# EAGLE design arbotix (EAGLE 5.07)
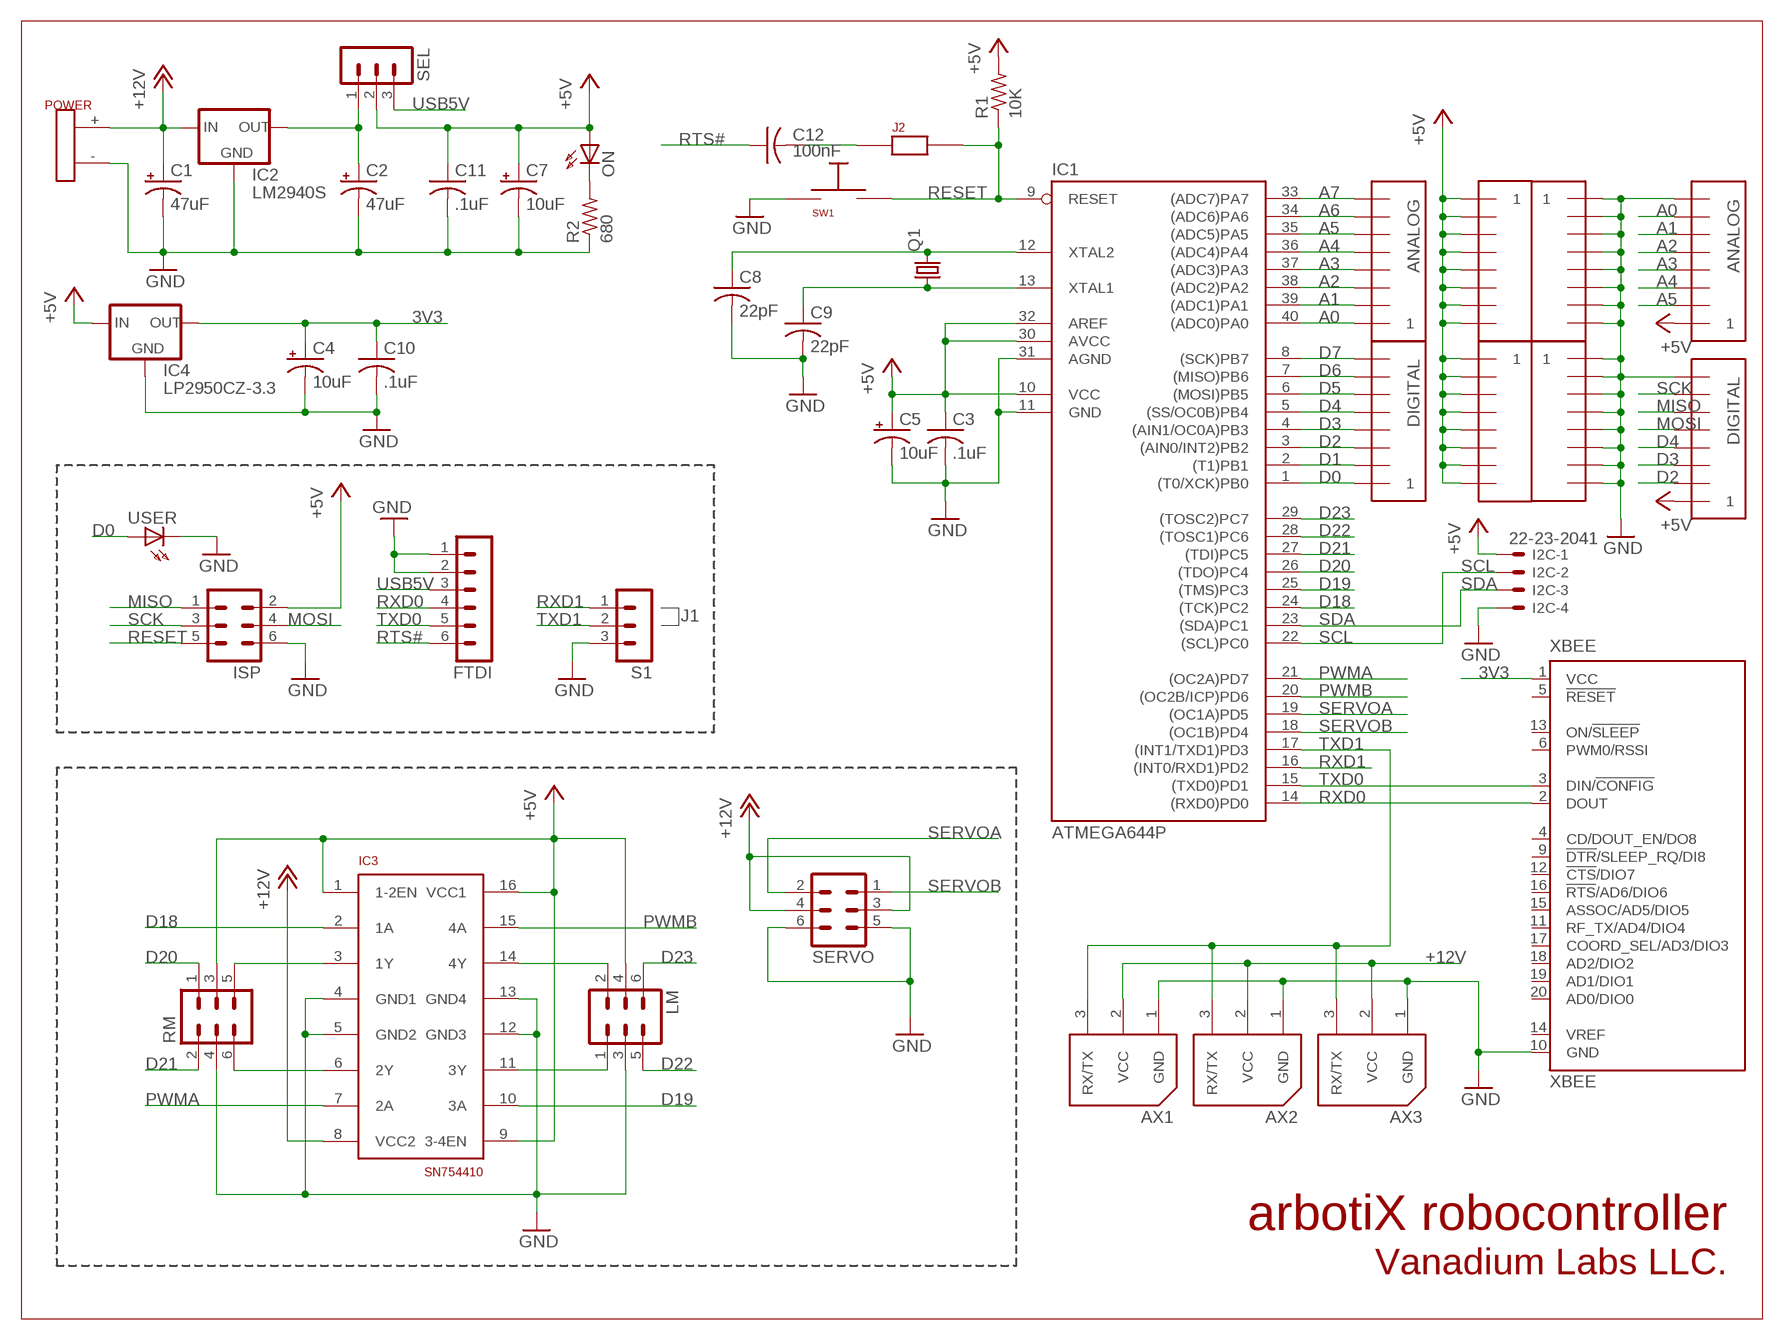
[diagram p0: schematic, sheet 1]

## Parts
AX1  WM18887-ND  [BIOLOID]
AX2  WM18887-ND  [BIOLOID]
AX3  WM18887-ND  [BIOLOID]
C1  47uF  CPOL-USTT2D5  [TT2D5]
C2  47uF  CPOL-USTT2D5  [TT2D5]
C3  .1uF  C-US025-024X044  [C025-024X044]
C4  10uF  CPOL-USTT2D5  [TT2D5]
C5  10uF  CPOL-USTT2D5  [TT2D5]
C7  10uF  CPOL-USTT2D5  [TT2D5]
C8  22pF  C-US025-024X044  [C025-024X044]
C9  22pF  C-US025-024X044  [C025-024X044]
C10  .1uF  C-US025-024X044  [C025-024X044]
C11  .1uF  C-US025-024X044  [C025-024X044]
C12  100nF  C-US025-024X044  [C025-024X044]
FTDI  MA06-1  [MA06-1]
I2C  22-23-2041  [22-23-2041]
IC1  ATMEGA644P  ATMEGA324P  [DIL40]
IC2  LM2940S  [TO220S]
IC3  SN754410  [DIL16]
IC4  LP2950CZ-3.3  [TO92]
ISP  MA03-2  [MA03-2]
J2  JUMPER  [2-PIN]
LM  MA03-2  [MA03-2]
ON  LED3MM  [LED3MM]
POWER  POWER  [POWER]
Q1  HC49/S  [HC49/S]
R1  10K  R-US_0204/7  [0204/7]
R2  680  R-US_0204/7  [0204/7]
RM  MA03-2  [MA03-2]
S1  MA03-1  [MA03-1]
SEL  MA03-1  [MA03-1]
SERVO  MA03-2  [MA03-2]
SW1  400-1646-ND  [MINISW]
U$1  HEADER8  [1X8]
U$2  HEADER8  [1X8]
U$3  HEADER16  [2X8]
U$4  HEADER8  [1X8]
U$11  HEADER16  [2X8]
U$12  HEADER8  [1X8]
USER  LED3MM  [LED3MM]
XBEE  XBEE  [XBEE]

## Nets
3V3: C4.+ C10.1 IC4.1(OUT) XBEE.1(VCC)
+5V: C3.1 C5.+ C7.+ C11.1 I2C.1 IC1.10(VCC) IC1.30(AVCC) IC1.32(AREF) IC3.1(1-2EN) IC3.9(3-4EN) IC3.16(VCC1) IC4.3(IN) ISP.2 LM.4 ON.A R1.2 RM.3 SEL.2 U$3.P$1 U$3.P$2 U$3.P$3 U$3.P$4 U$3.P$5 U$3.P$6 U$3.P$7 U$3.P$8 U$4.P$1 U$11.P$1 U$11.P$2 U$11.P$3 U$11.P$4 U$11.P$5 U$11.P$6 U$11.P$7 U$11.P$8 U$12.P$1
+12V: AX1.2(VCC) AX2.2(VCC) AX3.2(VCC) C1.+ IC2.1(IN) IC3.8(VCC2) POWER.+ SERVO.3 SERVO.4
A0: IC1.40((ADC0)PA0) U$1.P$1 U$12.P$7
A1: IC1.39((ADC1)PA1) U$1.P$2 U$12.P$6
A2: IC1.38((ADC2)PA2) U$1.P$3 U$12.P$5
A3: IC1.37((ADC3)PA3) U$1.P$4 U$12.P$4
A4: IC1.36((ADC4)PA4) U$1.P$5 U$12.P$3
A5: IC1.35((ADC5)PA5) U$1.P$6 U$12.P$2
A6: IC1.34((ADC6)PA6) U$1.P$7
A7: IC1.33((ADC7)PA7) U$1.P$8
D0: IC1.1((T0/XCK)PB0) U$2.P$1 USER.A
D1: IC1.2((T1)PB1) U$2.P$2
D2: IC1.3((AIN0/INT2)PB2) U$2.P$3 U$4.P$2
D3: IC1.4((AIN1/OC0A)PB3) U$2.P$4 U$4.P$3
D4: IC1.5((SS/OC0B)PB4) U$2.P$5 U$4.P$4
D18: IC1.24((TCK)PC2) IC3.2(1A)
D19: IC1.25((TMS)PC3) IC3.10(3A)
D20: IC1.26((TDO)PC4) RM.1
D21: IC1.27((TDI)PC5) RM.2
D22: IC1.28((TOSC1)PC6) LM.5
D23: IC1.29((TOSC2)PC7) LM.6
GND: AX1.1(GND) AX2.1(GND) AX3.1(GND) C1.- C2.- C3.2 C4.- C5.- C7.- C8.2 C9.2 C10.2 C11.2 FTDI.1 FTDI.2 I2C.4 IC1.11(GND) IC1.31(AGND) IC2.2(GND) IC3.4(GND1) IC3.5(GND2) IC3.12(GND3) IC3.13(GND4) IC4.2(GND) ISP.6 LM.3 POWER.- R2.1 RM.4 S1.3 SERVO.5 SERVO.6 SW1.2 U$3.P$9 U$3.P$10 U$3.P$11 U$3.P$12 U$3.P$13 U$3.P$14 U$3.P$15 U$3.P$16 U$4.P$8 U$11.P$9 U$11.P$10 U$11.P$11 U$11.P$12 U$11.P$13 U$11.P$14 U$11.P$15 U$11.P$16 U$12.P$8 USER.K(C) XBEE.10(GND)
MISO: IC1.7((MISO)PB6) ISP.1 U$2.P$7 U$4.P$6
MOSI: IC1.6((MOSI)PB5) ISP.4 U$2.P$6 U$4.P$5
N$1: IC3.11(3Y) LM.1
N$2: IC3.14(4Y) LM.2
N$3: IC3.3(1Y) RM.5
N$4: IC3.6(2Y) RM.6
N$5: C2.+ IC2.3(OUT) SEL.1
N$8: ON.K(C) R2.2
N$9: C8.1 IC1.12(XTAL2) Q1.2
N$11: C12.2 J2.P$1
N$13: C9.1 IC1.13(XTAL1) Q1.1
PWMA: IC1.21((OC2A)PD7) IC3.7(2A)
PWMB: IC1.20((OC2B/ICP)PD6) IC3.15(4A)
RESET: IC1.9(RESET) ISP.5 J2.P$2 R1.1 SW1.1
RTS#: C12.1 FTDI.6
RXD0: FTDI.4 IC1.14((RXD0)PD0) XBEE.2(DOUT)
RXD1: IC1.16((INT0/RXD1)PD2) S1.1
SCK: IC1.8((SCK)PB7) ISP.3 U$2.P$8 U$4.P$7
SCL: I2C.2 IC1.22((SCL)PC0)
SDA: I2C.3 IC1.23((SDA)PC1)
SERVOA: IC1.19((OC1A)PD5) SERVO.2
SERVOB: IC1.18((OC1B)PD4) SERVO.1
TXD0: FTDI.5 IC1.15((TXD0)PD1) XBEE.3(DIN/!CONFIG)
TXD1: AX1.3(RX/TX) AX2.3(RX/TX) AX3.3(RX/TX) IC1.17((INT1/TXD1)PD3) S1.2
USB5V: FTDI.3 SEL.3
Unconnected: XBEE.4(CD/DOUT_EN/DO8) XBEE.5(!RESET) XBEE.6(PWM0/RSSI) XBEE.9(!DTR!/SLEEP_RQ/DI8) XBEE.11(RF_TX/AD4/DIO4) XBEE.12(!CTS!/DIO7) XBEE.13(ON/!SLEEP) XBEE.14(VREF) XBEE.15(ASSOC/AD5/DIO5) XBEE.16(!RTS!/AD6/DIO6) XBEE.17(COORD_SEL/AD3/DIO3) XBEE.18(AD2/DIO2) XBEE.19(AD1/DIO1) XBEE.20(AD0/DIO0)

## Notes on the sheet
- ANALOG | ANALOG
- D7 | DIGITAL
- D6 | DIGITAL
- D5
- J1
- AX1 | AX2 | AX3
- arbotiX robocontroller
- Vanadium Labs LLC.

## Library data of the parts
AX1-AX3 = robots:WM18887-ND: Bioloid Bus Header Digikey Part No: WM18887-ND Molex/Waldom Electronics Corp 22-03-5035
C1 C2 C4 C5 C7 = rcl:CPOL-US: POLARIZED CAPACITOR, American symbol
C3 C8-C12 = rcl:C-US: CAPACITOR, American symbol
FTDI = con-lstb:MA06-1: PIN HEADER
I2C = con-molex:22-23-2041: .100" (2.54mm) Center Header - 4 Pin
IC1 = avr:ATMEGA324P
IC2 = robots:LM2940: LM2940 LDO REGULATOR
IC3 = robots:SN754410
IC4 = v-reg:LP2950?*: Source: http://cache.national.com/ds/LP/LP2950.pdf
ISP LM RM SERVO = con-lstb:MA03-2: PIN HEADER
J2 = robots:JUMPER
ON USER = led:LED3MM: LED 3 mm, round
POWER = robots:POWER
Q1 = crystal:HC49/S: CRYSTAL
R1 R2 = rcl:R-US_: RESISTOR, American symbol
S1 SEL = con-lstb:MA03-1: PIN HEADER
SW1 = robots:400-1646-ND: Mini Switch
U$1 U$2 U$4 U$12 = robots:HEADER8
U$3 U$11 = robots:HEADER16
XBEE = maxstream:XBEE: XBee (TM) /XBee-PRO(TM) OEM RF Modules Source: MaxStream, Inc. xbee_productmanual.pdf

## Board
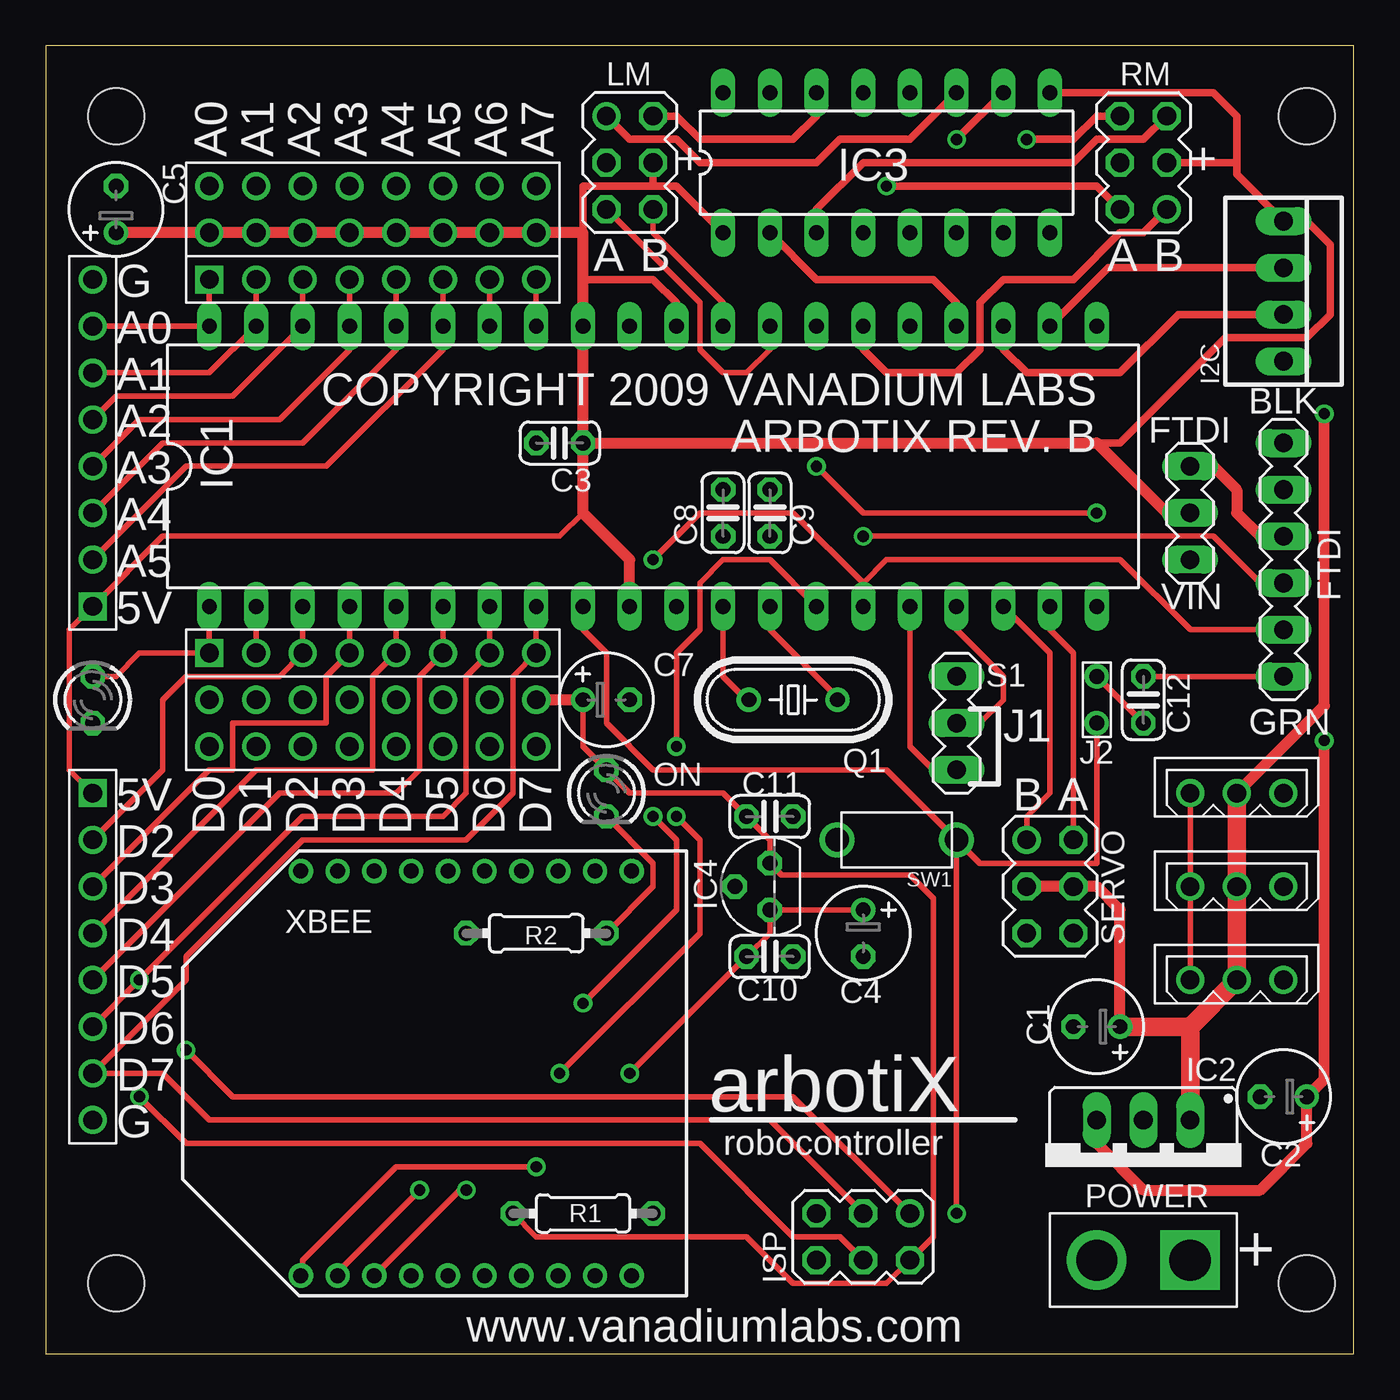
[diagram p1: board, top side]
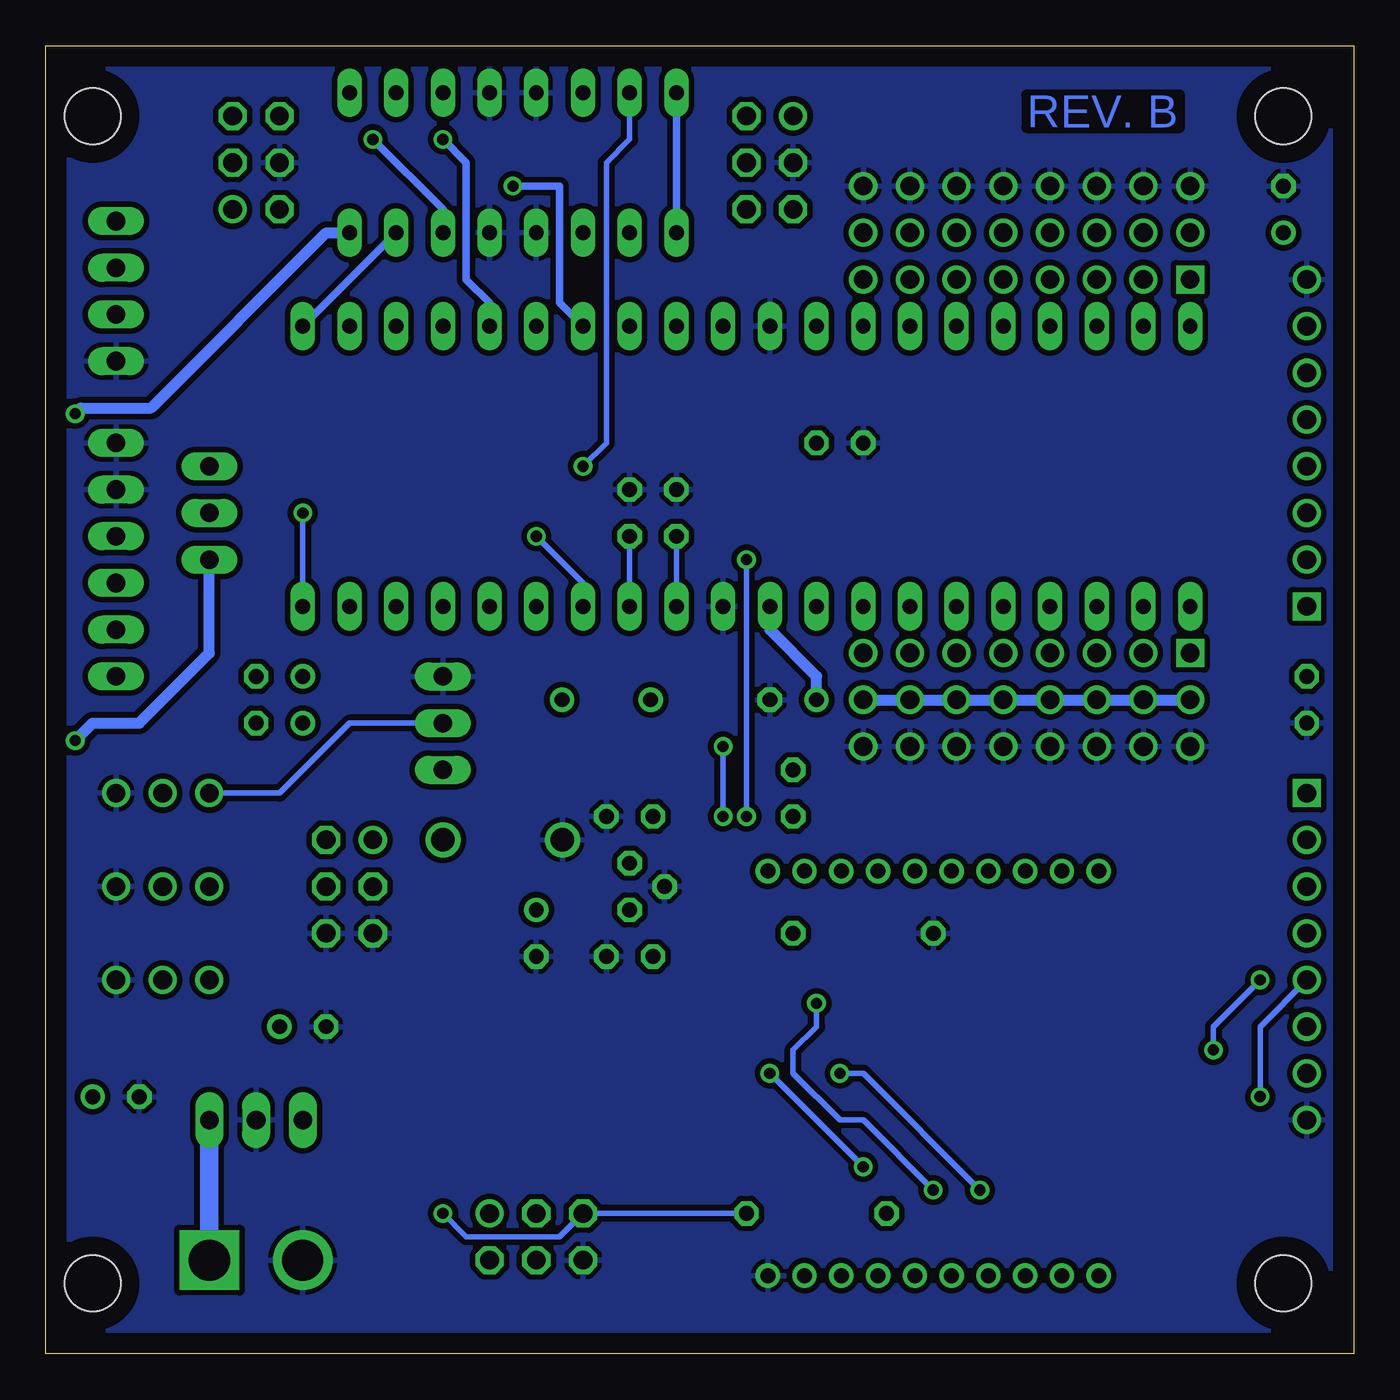
[diagram p2: board, bottom side, seen from below]

Size 71.12 x 71.12 mm. Coordinates in mm from the lower left corner, seen from the top.
Outline: 0,0 71.12,0 71.12,71.12 0,71.12 0,0
Copper layers (1*16): Top 0.035mm / dielectric 1.5mm / Bottom 0.035mm
Design rules "default *": minimum track width 10mil, minimum drill 24mil, track to track 8mil, track to pad 8mil, pad to pad 8mil, via to via 8mil, smd to smd 8mil, copper to edge 40mil, drill to drill 8mil, minimum pad ring 10mil, minimum via ring 8mil, stop-mask expansion 4mil, vias tented up to drill 24mil, thermal gap 10mil
Holes 3.05 mm at 3.81,67.31 68.58,67.31 68.58,3.81 3.81,3.81

### Footprints (pad centres in the part's own frame; a part is rotated, then mirrored left to right if it is on the bottom)
BIOLOID = drill 1.016 round: 1 0,0; 2 2.54,0; 3 5.08,0
TT2D5 = drill 0.813 round: + -1.27,0 | drill 0.813 octagon: - 1.27,0
C025-024X044 = drill 0.813 octagon: 1 -1.27,0; 2 1.27,0
MA06-1 = drill 1.016 long: 1 -6.35,0; 2 -3.81,0; 3 -1.27,0; 4 1.27,0; 5 3.81,0; 6 6.35,0
22-23-2041 = drill 1.016 long: 1 -3.81,0; 2 -1.27,0; 3 1.27,0; 4 3.81,0
DIL40 = drill 0.813 long: 1 -24.13,-7.62; 2 -21.59,-7.62; 3 -19.05,-7.62; 4 -16.51,-7.62; 5 -13.97,-7.62; 6 -11.43,-7.62; 7 -8.89,-7.62; 8 -6.35,-7.62; 9 -3.81,-7.62; 10 -1.27,-7.62; 11 1.27,-7.62; 12 3.81,-7.62; 13 6.35,-7.62; 14 8.89,-7.62; 15 11.43,-7.62; 16 13.97,-7.62; 17 16.51,-7.62; 18 19.05,-7.62; 19 21.59,-7.62; 20 24.13,-7.62; 21 24.13,7.62; 22 21.59,7.62; 23 19.05,7.62; 24 16.51,7.62; 25 13.97,7.62; 26 11.43,7.62; 27 8.89,7.62; 28 6.35,7.62; 29 3.81,7.62; 30 1.27,7.62; 31 -1.27,7.62; 32 -3.81,7.62; 33 -6.35,7.62; 34 -8.89,7.62; 35 -11.43,7.62; 36 -13.97,7.62; 37 -16.51,7.62; 38 -19.05,7.62; 39 -21.59,7.62; 40 -24.13,7.62
TO220S = drill 1.016 long: 1 -2.54,1.27; 2 0,1.27; 3 2.54,1.27
DIL16 = drill 0.813 long: 1 -8.89,-3.81; 2 -6.35,-3.81; 3 -3.81,-3.81; 4 -1.27,-3.81; 5 1.27,-3.81; 6 3.81,-3.81; 7 6.35,-3.81; 8 8.89,-3.81; 9 8.89,3.81; 10 6.35,3.81; 11 3.81,3.81; 12 1.27,3.81; 13 -1.27,3.81; 14 -3.81,3.81; 15 -6.35,3.81; 16 -8.89,3.81
TO92 = drill 0.813 octagon: 1 -1.27,0; 2 0,1.905; 3 1.27,0
MA03-2 = drill 1.016 round: 1 -2.54,-1.27 | drill 1.016 octagon: 2 -2.54,1.27; 3 0,-1.27; 4 0,1.27; 5 2.54,-1.27; 6 2.54,1.27
2-PIN = drill 0.813 round: P$1 -1.27,0; P$2 1.27,0
LED3MM = drill 0.813 octagon: A -1.27,0; K 1.27,0
POWER = drill 2.235 square: + 0,0 | drill 2.235 round: - 5.08,0
HC49/S = drill 0.813 round: 1 -2.413,0; 2 2.413,0
0204/7 = drill 0.813 octagon: 1 -3.81,0; 2 3.81,0
MA03-1 = drill 1.016 long: 1 -2.54,0; 2 0,0; 3 2.54,0
MINISW = drill 1.27 round: 1 0,0; 2 6.5,0
1X8 = drill 1.016 square: P$1 0,0 | drill 1.016 round: P$2 2.54,0; P$3 5.08,0; P$4 7.62,0; P$5 10.16,0; P$6 12.7,0; P$7 15.24,0; P$8 17.78,0
2X8 = drill 1.016 round: P$1 0,0; P$2 2.54,0; P$3 5.08,0; P$4 7.62,0; P$5 10.16,0; P$6 12.7,0; P$7 15.24,0; P$8 17.78,0; P$9 0,2.54; P$10 2.54,2.54; P$11 5.08,2.54; P$12 7.62,2.54; P$13 10.16,2.54; P$14 12.7,2.54; P$15 15.24,2.54; P$16 17.78,2.54
XBEE = drill 0.813 pad 1.27 round: 1 -11,9; 2 -11,7; 3 -11,5; 4 -11,3; 5 -11,1; 6 -11,-1; 7 -11,-3; 8 -11,-5; 9 -11,-7; 10 -11,-9; 11 11,-9; 12 11,-7; 13 11,-5; 14 11,-3; 15 11,-1; 16 11,1; 17 11,3; 18 11,5; 19 11,7; 20 11,9

### Placement (x,y rotation side)
AX1  67.31,20.32 180 top
AX2  67.31,25.4 180 top
AX3  67.31,30.48 180 top
C1  57.15,17.78 180 top
C2  67.31,13.97 180 top
C3  27.94,49.53 180 top
C4  44.45,22.86 270 top
C5  3.81,62.23 90 top
C7  30.48,35.56 0 top
C8  36.83,45.72 90 top
C9  39.37,45.72 90 top
C10  39.37,21.59 0 top
C11  39.37,29.21 0 top
C12  59.69,35.56 270 top
FTDI  67.31,43.18 270 top
I2C  67.31,57.78 270 top
IC1  33.02,48.26 0 top
IC2  59.69,13.97 180 top
IC3  45.72,64.77 0 top
IC4  39.37,25.4 90 top
ISP  44.45,6.35 180 top
J2  57.15,35.56 270 top
LM  31.75,64.77 270 top
ON  30.48,30.48 270 top
POWER  62.23,5.08 180 top
Q1  40.64,35.56 180 top
R1  29.21,7.62 180 top
R2  26.67,22.86 0 top
RM  59.69,64.77 90 top
S1  49.53,34.29 90 top
SEL  62.23,45.72 90 top
SERVO  54.61,25.4 270 top
SW1  49.53,27.94 180 top
U$1  8.89,58.42 0 top
U$2  8.89,38.1 0 top
U$3  8.89,60.96 0 top
U$4  2.54,30.48 270 top
U$11  26.67,35.56 180 top
U$12  2.54,40.64 90 top
USER  2.54,35.56 270 top
XBEE  22.86,15.24 90 top

### Tracks (layer width: path | path; a pad name or v marks a point on that pad's centre or on a via)
3V3  (via drill 0.61)
  Top 0.305: C4.+ IC4.1 39.37,22.86 C10.1 v31.75,15.24 | v26.67,10.16 19.05,10.16 13.97,5.08 13.97,4.35 XBEE.1
  Bottom 0.305: v26.67,10.16 v31.75,15.24
+5V
  Top 0.305: 29.21,45.72 27.94,44.45 6.35,44.45 U$12.P$1 1.27,39.37 1.27,31.75 U$4.P$1 | C7.+ 29.21,33.02 ON.A 31.75,30.48 36.83,30.48 C11.1 39.37,27.94 IC4.3 40.01,26.04 46.99,26.04 48.26,24.77 48.26,6.35 ISP.2 45.72,3.81 40.64,3.81 38.1,6.35 26.67,6.35 R1.2
  Top 0.406: 29.21,60.96 29.21,63.5 33.02,63.5 | IC1.30 34.29,57.15 33.02,58.42 29.21,58.42 | 64.77,64.77 64.77,64.14 I2C.1 68.58,61.59 69.85,60.33 69.85,56.52 68.58,55.24 64.14,55.24 58.42,49.53 57.15,49.53 | 64.77,64.77 RM.3 | IC3.9 63.5,68.58 64.77,67.31 64.77,64.77 | IC3.1 34.29,63.5 33.02,63.5 | 33.02,63.5 LM.4
  Top 0.61: C5.+ U$3.P$1 U$3.P$2 U$3.P$3 U$3.P$4 U$3.P$5 U$3.P$6 U$3.P$7 U$3.P$8 29.21,60.96 29.21,58.42 IC1.32 C3.1 | C3.1 57.15,49.53 60.96,45.72 SEL.2 | C3.1 29.21,45.72 31.75,43.18 IC1.10 | C7.+ U$11.P$1
  Bottom 0.406: IC3.1 IC3.16
  Bottom 0.61: IC1.10 31.75,39.37 29.21,36.83 C7.+ | U$11.P$1 U$11.P$2 U$11.P$3 U$11.P$4 U$11.P$5 U$11.P$6 U$11.P$7 U$11.P$8
+12V  (via drill 0.61)
  Top 0.61: v69.53,51.12 69.53,35.24 AX3.2 | SERVO.3 SERVO.4 57.15,25.4 58.42,24.13 C1.+
  Top 1.016: AX3.2 AX2.2 AX1.2 62.23,17.78 | IC2.1 62.23,17.78 | 62.23,17.78 C1.+
  Bottom 0.61: IC3.8 55.88,60.96 65.41,51.44 69.22,51.44 v69.53,51.12
  Bottom 1.016: POWER.+ IC2.1
A0
  Top 0.305: U$1.P$1 IC1.40 U$12.P$7
A1
  Top 0.305: U$12.P$6 8.89,53.34 IC1.39 U$1.P$2
A2
  Top 0.305: U$12.P$5 3.81,52.07 10.16,52.07 IC1.38 U$1.P$3
A3
  Top 0.305: U$12.P$4 5.08,50.8 12.7,50.8 16.51,54.61 IC1.37 U$1.P$4
A4
  Top 0.305: U$12.P$3 6.35,49.53 13.97,49.53 19.05,54.61 IC1.36 | IC1.36 19.05,57.15 | IC1.36 U$1.P$5
A5
  Top 0.305: U$1.P$6 IC1.35 21.59,54.61 15.24,48.26 7.62,48.26 U$12.P$2
A6
  Top 0.305: IC1.34 U$1.P$7
A7
  Top 0.305: IC1.33 U$1.P$8
D0
  Top 0.305: IC1.1 U$2.P$1 5.08,38.1 3.81,36.83 USER.A
D1
  Top 0.305: U$2.P$2 IC1.2
D2
  Top 0.305: IC1.3 U$2.P$3 12.7,36.83 7.62,36.83 6.35,35.56 6.35,31.75 U$4.P$2
D3
  Top 0.305: IC1.4 U$2.P$4 15.24,36.83 15.24,34.29 10.16,34.29 10.16,31.75 8.89,31.75 U$4.P$3
D4
  Top 0.305: IC1.5 U$2.P$5 17.78,36.83 17.78,31.75 11.43,31.75 U$4.P$4
D18
  Top 0.406: IC3.2 41.91,58.42 48.26,58.42 49.53,57.15 IC1.24
D19  (via drill 0.61)
  Top 0.406: v49.53,66.04 IC3.10
  Bottom 0.406: v49.53,66.04 48.26,64.77 48.26,58.42 46.99,57.15 IC1.25
D20
  Top 0.406: RM.1 59.69,60.96 58.42,60.96 55.88,58.42 52.07,58.42 50.8,57.15 50.8,54.61 49.53,53.34 45.72,53.34 44.45,54.61 IC1.26
D21  (via drill 0.61)
  Top 0.406: RM.2 57.15,63.5 v45.72,63.5
  Bottom 0.406: v45.72,63.5 43.18,63.5 43.18,57.15 IC1.27
D22
  Top 0.305: LM.5 35.56,57.15 35.56,54.61 36.83,53.34 38.1,53.34 39.37,54.61 IC1.28
D23
  Top 0.305: LM.6 33.02,60.96 36.83,57.15 IC1.29
GND
  pour Bottom (isolate 0.305): 1.27,69.85 1.27,1.27 69.85,1.27 69.85,69.85
MISO  (via drill 0.61)
  Top 0.305: IC1.7 U$2.P$7 22.86,36.83 22.86,30.48 21.59,29.21 13.97,29.21 v5.08,20.32 U$4.P$6 | ISP.1 40.64,13.97 10.16,13.97 v7.62,16.51
  Bottom 0.305: v7.62,16.51 7.62,17.78 v5.08,20.32
MOSI  (via drill 0.61)
  Top 0.305: IC1.6 U$2.P$6 20.32,36.83 20.32,31.75 19.05,30.48 12.7,30.48 U$4.P$5 | ISP.4 43.18,6.35 40.64,6.35 35.56,11.43 7.62,11.43 v5.08,13.97
  Bottom 0.305: v5.08,13.97 5.08,17.78 U$4.P$5
N$1
  Top 0.406: LM.1 31.75,66.04 34.29,66.04 35.56,64.77 41.91,64.77 43.18,66.04 46.99,66.04 IC3.11
N$2
  Top 0.406: LM.2 34.29,67.31 35.56,66.04 40.64,66.04 41.91,67.31 IC3.14
N$3
  Top 0.406: RM.5 59.69,66.04 57.15,66.04 55.88,64.77 44.45,64.77 41.91,62.23 IC3.3
N$4  (via drill 0.61)
  Top 0.406: RM.6 57.15,67.31 55.88,66.04 v53.34,66.04
  Bottom 0.406: v53.34,66.04 49.53,62.23 IC3.6
N$5  (via drill 0.61)
  Top 0.61: v69.53,33.34 69.53,14.92 C2.+ 68.58,11.43 66.04,8.89 59.69,8.89 57.15,11.43 IC2.3
  Bottom 0.61: SEL.1 62.23,38.1 66.04,34.29 68.58,34.29 v69.53,33.34
N$8
  Top 0.305: ON.K 33.02,26.67 33.02,25.4 R2.2
N$9
  Top 0.305: Q1.2 38.1,35.56 36.83,36.83 IC1.12
  Bottom 0.305: IC1.12 C8.1
N$11
  Top 0.305: C12.2 J2.P$1
N$13
  Top 0.305: Q1.1 43.05,35.69 39.37,39.37 IC1.13
  Bottom 0.305: IC1.13 C9.1
PWMA
  Bottom 0.406: IC3.7 IC1.21
PWMB  (via drill 0.61)
  Top 0.305: v41.91,48.26 44.45,45.72 v57.15,45.72
  Bottom 0.305: IC3.15 39.37,66.04 40.64,64.77 40.64,49.53 v41.91,48.26 | v57.15,45.72 IC1.20
RESET  (via drill 0.61)
  Top 0.305: J2.P$2 57.15,26.67 50.8,26.67 SW1.1 | v49.53,7.62 SW1.1 | SW1.1 45.72,31.75 33.02,31.75 30.48,34.29 30.48,38.1 29.21,39.37 IC1.9
  Bottom 0.305: v49.53,7.62 48.26,6.35 43.18,6.35 ISP.5 R1.1
RTS#
  Top 0.305: C12.1 FTDI.6
RXD0  (via drill 0.61)
  Top 0.305: IC1.14 39.37,43.18 36.83,43.18 35.56,41.91 35.56,39.37 34.29,38.1 v34.29,33.02 | FTDI.4 66.04,41.91 63.5,44.45 v44.45,44.45 | v34.29,29.21 35.56,27.94 35.56,22.86 v27.94,15.24 | XBEE.2 15.86,4.43 v20.32,8.89
  Bottom 0.305: v34.29,29.21 v34.29,33.02 | v44.45,44.45 41.91,41.91 IC1.14 | v20.32,8.89 26.67,15.24 v27.94,15.24
RXD1
  Top 0.305: IC1.16 46.99,33.02 48.26,31.75 S1.1
SCK
  Top 0.305: IC1.8 U$2.P$8 25.4,36.83 25.4,30.48 22.86,27.94 13.97,27.94 7.62,21.59 7.62,20.32 U$4.P$7 6.35,15.24 8.89,12.7 39.37,12.7 ISP.3
SCL
  Top 0.406: I2C.2 57.78,59.05 IC1.22
SDA
  Top 0.406: IC1.23 52.07,54.61 53.34,53.34 58.42,53.34 61.59,56.52 I2C.3
SERVOA
  Top 0.305: IC1.19 54.61,39.37 55.88,38.1 SERVO.2
SERVOB
  Top 0.305: IC1.18 54.61,38.1 54.61,30.48 53.34,29.21 SERVO.1
TXD0  (via drill 0.61)
  Top 0.305: 44.45,41.91 40.64,45.72 35.56,45.72 v33.02,43.18 | v33.02,29.21 34.29,27.94 34.29,24.13 v29.21,19.05 | 44.45,41.91 IC1.15 | 44.45,41.91 45.72,43.18 58.42,43.18 62.23,39.37 FTDI.5 | v22.86,8.89 22.51,8.89 XBEE.3
  Bottom 0.305: v33.02,29.21 v33.02,43.18 | v29.21,19.05 29.21,17.78 30.48,16.51 30.48,15.24 27.94,12.7 26.67,12.7 v22.86,8.89
TXD1
  Top 0.305: S1.2 50.8,34.29 52.07,35.56 52.07,36.83 49.53,39.37 IC1.17 | AX3.3 AX2.3 AX1.3
  Bottom 0.305: S1.2 54.61,34.29 58.42,30.48 AX3.3
USB5V
  Top 0.61: SEL.3 63.5,48.26 64.77,46.99 64.77,45.72 66.04,44.45 FTDI.3

### Text on the board
Bottom: REV. B
tPlace: J1
tNames: A0 | A1 | A2 | A3 | A4 | A5 | A6 | A7 | + | + | A | B | A | B | G | A0 | COPYRIGHT 2009 VANADIUM LABS | A1 | ARBOTIX REV. B | FTDI | BLK | A2 | A3 | A4 | A5 | 5V | VIN | GRN | D0 | D1 | D2 | D3 | D4 | D5 | D6 | D7 | 5V | B | A | D2 | D3 | D4 | D5 | D6 | D7 | arbotiX | G | robocontroller | + | www.vanadiumlabs.com